# Altium schematic sheet PowerPC_AMCC_PPC405CR_VGA.SchDoc: FPGA PPC405 VGA example
size C; Organization: Altium Limited; Address1: L3, 12a Rodborough Rd; Address2: Frenchs Forest; Address3: NSW; Address4: Australia 2086; DocumentNumber: 1; SheetNumber: 1; SheetTotal: 1
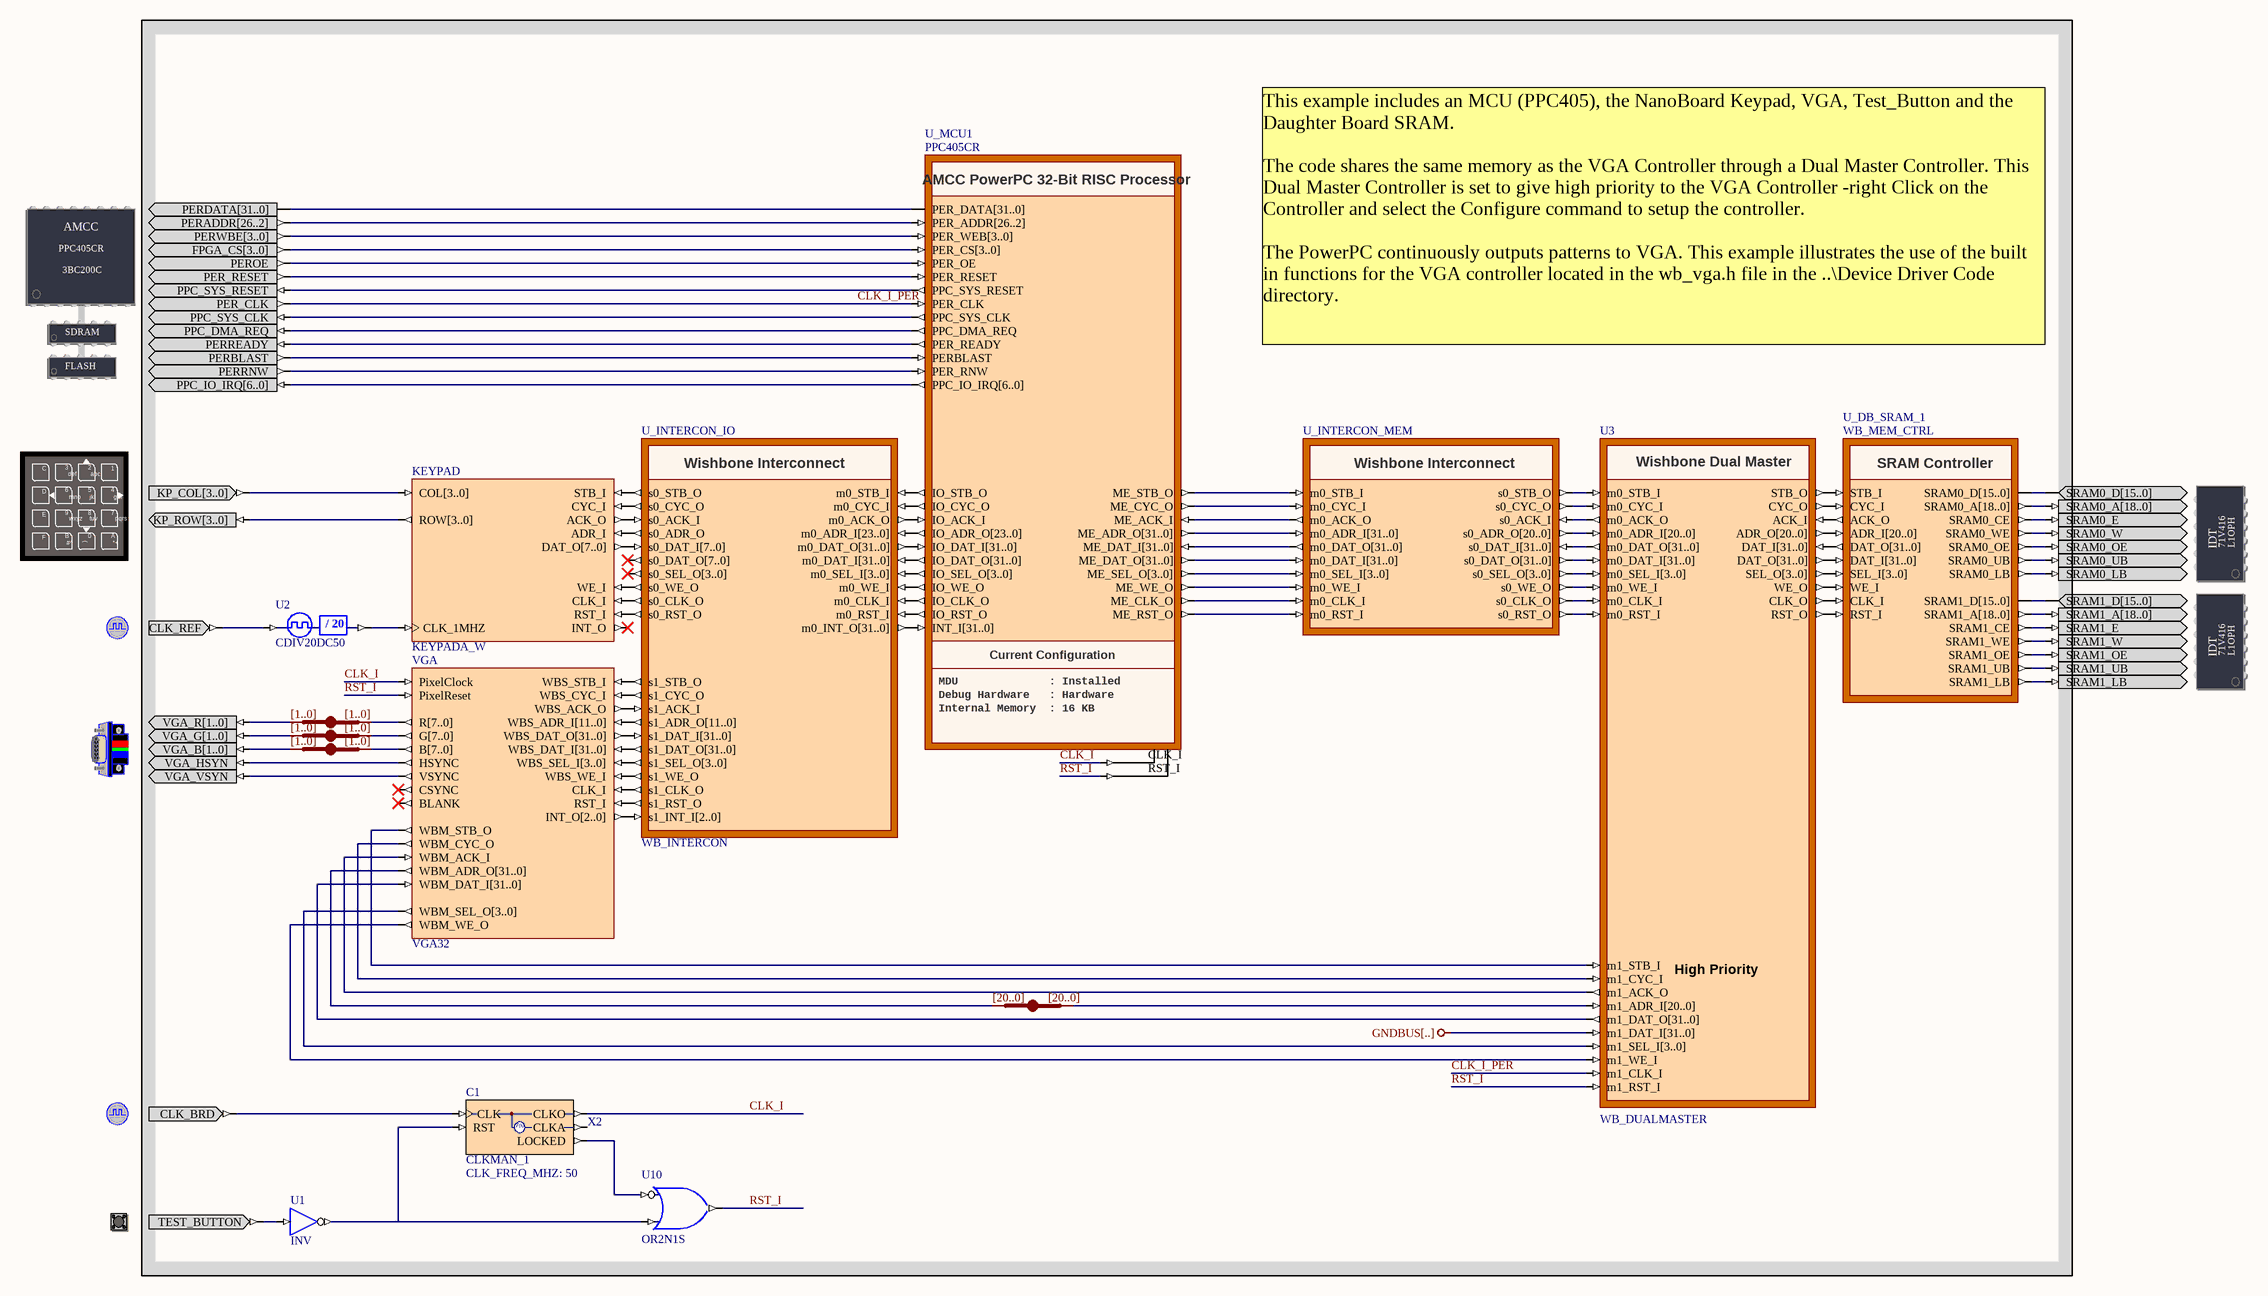
[diagram p0: PowerPC_AMCC_PPC405CR_VGA.SchDoc]

## Parts
(Parts that share a designator on the sheet are numbered #1, #2 ... from top to bottom, then left to right.)
?#1  PROCESSOR_PPC405CR  (value not drawn)
?#2  KEYPAD  (value not drawn)
?#3  SRAM_DAUGHTER0  (value not drawn)
?#4  SRAM_DAUGHTER1  (value not drawn)
?#5  CLOCK_REFERENCE  (value not drawn)
?#6  VGACNTR  (value not drawn)
?#7  CLOCK_BOARD  (value not drawn)
?#8  TEST_BUTTON  (value not drawn)
C1  CLKMAN_1  CLK_FREQ_MHZ: 50  ClkA_Operation: X2
JB_AUTO?#1  IndexA: [1..0]  (hidden comment: JB)
JB_AUTO?#2  IndexA: [1..0]  (hidden comment: JB)
JB_AUTO?#3  IndexA: [1..0]  (hidden comment: JB)
JB_AUTO?#4  IndexA: [20..0]  (hidden comment: JB)
KEYPAD  KEYPADA_W
U1  INV
U2  CDIV20DC50
U3  WB_DUALMASTER
U10  OR2N1S
U_DB_SRAM_1  WB_MEM_CTRL
U_INTERCON_IO  WB_INTERCON
U_INTERCON_MEM  (no value)
U_MCU1  PPC405CR
VGA  VGA32

## Nets
GNDBUS[..]: U3.m1_DAT_I[31..0]
CLK_I: C1.CLKO U_MCU1.CLK_I VGA.PixelClock
CLK_I_PER: ?#1.PER_CLK U3.m1_CLK_I U_MCU1.PER_CLK
RST_I: U3.m1_RST_I U10.O U_MCU1.RST_I VGA.PixelReset
Net?#1_FPGA_CS[3..0]: ?#1.FPGA_CS[3..0] U_MCU1.PER_CS[3..0]
Net?#1_PER_RESET: ?#1.PER_RESET U_MCU1.PER_RESET
Net?#1_PERADDR[26..2]: ?#1.PERADDR[26..2] U_MCU1.PER_ADDR[26..2]
Net?#1_PERBLAST: ?#1.PERBLAST U_MCU1.PERBLAST
Net?#1_PERDATA[31..0]: ?#1.PERDATA[31..0] U_MCU1.PER_DATA[31..0]
Net?#1_PEROE: ?#1.PEROE U_MCU1.PER_OE
Net?#1_PERREADY: ?#1.PERREADY U_MCU1.PER_READY
Net?#1_PERRNW: ?#1.PERRNW U_MCU1.PER_RNW
Net?#1_PERWBE[3..0]: ?#1.PERWBE[3..0] U_MCU1.PER_WEB[3..0]
Net?#1_PPC_DMA_REQ: ?#1.PPC_DMA_REQ U_MCU1.PPC_DMA_REQ
Net?#1_PPC_IO_IRQ[6..0]: ?#1.PPC_IO_IRQ[6..0] U_MCU1.PPC_IO_IRQ[6..0]
Net?#1_PPC_SYS_CLK: ?#1.PPC_SYS_CLK U_MCU1.PPC_SYS_CLK
Net?#1_PPC_SYS_RESET: ?#1.PPC_SYS_RESET U_MCU1.PPC_SYS_RESET
Net?#2_KP_COL[3..0]: ?#2.KP_COL[3..0] KEYPAD.COL[3..0]
Net?#2_KP_ROW[3..0]: ?#2.KP_ROW[3..0] KEYPAD.ROW[3..0]
Net?#3_SRAM0_A[18..0]: ?#3.SRAM0_A[18..0] U_DB_SRAM_1.SRAM0_A[18..0]
Net?#3_SRAM0_D[15..0]: ?#3.SRAM0_D[15..0] U_DB_SRAM_1.SRAM0_D[15..0]
Net?#3_SRAM0_E: ?#3.SRAM0_E U_DB_SRAM_1.SRAM0_CE
Net?#3_SRAM0_LB: ?#3.SRAM0_LB U_DB_SRAM_1.SRAM0_LB
Net?#3_SRAM0_OE: ?#3.SRAM0_OE U_DB_SRAM_1.SRAM0_OE
Net?#3_SRAM0_UB: ?#3.SRAM0_UB U_DB_SRAM_1.SRAM0_UB
Net?#3_SRAM0_W: ?#3.SRAM0_W U_DB_SRAM_1.SRAM0_WE
Net?#4_SRAM1_A[18..0]: ?#4.SRAM1_A[18..0] U_DB_SRAM_1.SRAM1_A[18..0]
Net?#4_SRAM1_D[15..0]: ?#4.SRAM1_D[15..0] U_DB_SRAM_1.SRAM1_D[15..0]
Net?#4_SRAM1_E: ?#4.SRAM1_E U_DB_SRAM_1.SRAM1_CE
Net?#4_SRAM1_LB: ?#4.SRAM1_LB U_DB_SRAM_1.SRAM1_LB
Net?#4_SRAM1_OE: ?#4.SRAM1_OE U_DB_SRAM_1.SRAM1_OE
Net?#4_SRAM1_UB: ?#4.SRAM1_UB U_DB_SRAM_1.SRAM1_UB
Net?#4_SRAM1_W: ?#4.SRAM1_W U_DB_SRAM_1.SRAM1_WE
Net?#5_CLK_REF: ?#5.CLK_REF U2.CLKIN
Net?#6_VGA_B[1..0]: ?#6.VGA_B[1..0] JB_AUTO?#3.A[0..0]
Net?#6_VGA_G[1..0]: ?#6.VGA_G[1..0] JB_AUTO?#2.A[0..0]
Net?#6_VGA_HSYN: ?#6.VGA_HSYN VGA.HSYNC
Net?#6_VGA_R[1..0]: ?#6.VGA_R[1..0] JB_AUTO?#1.A[0..0]
Net?#6_VGA_VSYN: ?#6.VGA_VSYN VGA.VSYNC
Net?#7_CLK_BRD: ?#7.CLK_BRD C1.CLK
Net?#8_TEST_BUTTON: ?#8.TEST_BUTTON U1.I
NetC1_LOCKED: C1.LOCKED U10.I0
NetC1_RST: C1.RST U1.O U10.I1
NetJB_AUTO?#1_B[0..0]: JB_AUTO?#1.B[0..0] VGA.R[7..0]
NetJB_AUTO?#2_B[0..0]: JB_AUTO?#2.B[0..0] VGA.G[7..0]
NetJB_AUTO?#3_B[0..0]: JB_AUTO?#3.B[0..0] VGA.B[7..0]
NetJB_AUTO?#4_A[0..0]: JB_AUTO?#4.A[0..0] VGA.WBM_ADR_O[31..0]
NetJB_AUTO?#4_B[0..0]: JB_AUTO?#4.B[0..0] U3.m1_ADR_I[20..0]
NetKEYPAD_ACK_O: KEYPAD.ACK_O U_INTERCON_IO.s0_ACK_I
NetKEYPAD_ADR_I: KEYPAD.ADR_I U_INTERCON_IO.s0_ADR_O
NetKEYPAD_CLK_1MHZ: KEYPAD.CLK_1MHZ U2.CLKDV
NetKEYPAD_CLK_I: KEYPAD.CLK_I U_INTERCON_IO.s0_CLK_O
NetKEYPAD_CYC_I: KEYPAD.CYC_I U_INTERCON_IO.s0_CYC_O
NetKEYPAD_DAT_O[7..0]: KEYPAD.DAT_O[7..0] U_INTERCON_IO.s0_DAT_I[7..0]
NetKEYPAD_RST_I: KEYPAD.RST_I U_INTERCON_IO.s0_RST_O
NetKEYPAD_STB_I: KEYPAD.STB_I U_INTERCON_IO.s0_STB_O
NetKEYPAD_WE_I: KEYPAD.WE_I U_INTERCON_IO.s0_WE_O
NetU3_ACK_I: U3.ACK_I U_DB_SRAM_1.ACK_O
NetU3_ADR_O[20..0]: U3.ADR_O[20..0] U_DB_SRAM_1.ADR_I[20..0]
NetU3_CLK_O: U3.CLK_O U_DB_SRAM_1.CLK_I
NetU3_CYC_O: U3.CYC_O U_DB_SRAM_1.CYC_I
NetU3_DAT_I[31..0]: U3.DAT_I[31..0] U_DB_SRAM_1.DAT_O[31..0]
NetU3_DAT_O[31..0]: U3.DAT_O[31..0] U_DB_SRAM_1.DAT_I[31..0]
NetU3_m0_ACK_O: U3.m0_ACK_O U_INTERCON_MEM.s0_ACK_I
NetU3_m0_ADR_I[20..0]: U3.m0_ADR_I[20..0] U_INTERCON_MEM.s0_ADR_O[20..0]
NetU3_m0_CLK_I: U3.m0_CLK_I U_INTERCON_MEM.s0_CLK_O
NetU3_m0_CYC_I: U3.m0_CYC_I U_INTERCON_MEM.s0_CYC_O
NetU3_m0_DAT_I[31..0]: U3.m0_DAT_I[31..0] U_INTERCON_MEM.s0_DAT_O[31..0]
NetU3_m0_DAT_O[31..0]: U3.m0_DAT_O[31..0] U_INTERCON_MEM.s0_DAT_I[31..0]
NetU3_m0_RST_I: U3.m0_RST_I U_INTERCON_MEM.s0_RST_O
NetU3_m0_SEL_I[3..0]: U3.m0_SEL_I[3..0] U_INTERCON_MEM.s0_SEL_O[3..0]
NetU3_m0_STB_I: U3.m0_STB_I U_INTERCON_MEM.s0_STB_O
NetU3_m0_WE_I: U3.m0_WE_I U_INTERCON_MEM.s0_WE_O
NetU3_m1_ACK_O: U3.m1_ACK_O VGA.WBM_ACK_I
NetU3_m1_CYC_I: U3.m1_CYC_I VGA.WBM_CYC_O
NetU3_m1_DAT_O[31..0]: U3.m1_DAT_O[31..0] VGA.WBM_DAT_I[31..0]
NetU3_m1_SEL_I[3..0]: U3.m1_SEL_I[3..0] VGA.WBM_SEL_O[3..0]
NetU3_m1_STB_I: U3.m1_STB_I VGA.WBM_STB_O
NetU3_m1_WE_I: U3.m1_WE_I VGA.WBM_WE_O
NetU3_RST_O: U3.RST_O U_DB_SRAM_1.RST_I
NetU3_SEL_O[3..0]: U3.SEL_O[3..0] U_DB_SRAM_1.SEL_I[3..0]
NetU3_STB_O: U3.STB_O U_DB_SRAM_1.STB_I
NetU3_WE_O: U3.WE_O U_DB_SRAM_1.WE_I
NetU_INTERCON_IO_m0_ACK_O: U_INTERCON_IO.m0_ACK_O U_MCU1.IO_ACK_I
NetU_INTERCON_IO_m0_ADR_I[23..0]: U_INTERCON_IO.m0_ADR_I[23..0] U_MCU1.IO_ADR_O[23..0]
NetU_INTERCON_IO_m0_CLK_I: U_INTERCON_IO.m0_CLK_I U_MCU1.IO_CLK_O
NetU_INTERCON_IO_m0_CYC_I: U_INTERCON_IO.m0_CYC_I U_MCU1.IO_CYC_O
NetU_INTERCON_IO_m0_DAT_I[31..0]: U_INTERCON_IO.m0_DAT_I[31..0] U_MCU1.IO_DAT_O[31..0]
NetU_INTERCON_IO_m0_DAT_O[31..0]: U_INTERCON_IO.m0_DAT_O[31..0] U_MCU1.IO_DAT_I[31..0]
NetU_INTERCON_IO_m0_INT_O[31..0]: U_INTERCON_IO.m0_INT_O[31..0] U_MCU1.INT_I[31..0]
NetU_INTERCON_IO_m0_RST_I: U_INTERCON_IO.m0_RST_I U_MCU1.IO_RST_O
NetU_INTERCON_IO_m0_SEL_I[3..0]: U_INTERCON_IO.m0_SEL_I[3..0] U_MCU1.IO_SEL_O[3..0]
NetU_INTERCON_IO_m0_STB_I: U_INTERCON_IO.m0_STB_I U_MCU1.IO_STB_O
NetU_INTERCON_IO_m0_WE_I: U_INTERCON_IO.m0_WE_I U_MCU1.IO_WE_O
NetU_INTERCON_IO_s1_ACK_I: U_INTERCON_IO.s1_ACK_I VGA.WBS_ACK_O
NetU_INTERCON_IO_s1_ADR_O[11..0]: U_INTERCON_IO.s1_ADR_O[11..0] VGA.WBS_ADR_I[11..0]
NetU_INTERCON_IO_s1_CLK_O: U_INTERCON_IO.s1_CLK_O VGA.CLK_I
NetU_INTERCON_IO_s1_CYC_O: U_INTERCON_IO.s1_CYC_O VGA.WBS_CYC_I
NetU_INTERCON_IO_s1_DAT_I[31..0]: U_INTERCON_IO.s1_DAT_I[31..0] VGA.WBS_DAT_O[31..0]
NetU_INTERCON_IO_s1_DAT_O[31..0]: U_INTERCON_IO.s1_DAT_O[31..0] VGA.WBS_DAT_I[31..0]
NetU_INTERCON_IO_s1_INT_I[2..0]: U_INTERCON_IO.s1_INT_I[2..0] VGA.INT_O[2..0]
NetU_INTERCON_IO_s1_RST_O: U_INTERCON_IO.s1_RST_O VGA.RST_I
NetU_INTERCON_IO_s1_SEL_O[3..0]: U_INTERCON_IO.s1_SEL_O[3..0] VGA.WBS_SEL_I[3..0]
NetU_INTERCON_IO_s1_STB_O: U_INTERCON_IO.s1_STB_O VGA.WBS_STB_I
NetU_INTERCON_IO_s1_WE_O: U_INTERCON_IO.s1_WE_O VGA.WBS_WE_I
NetU_INTERCON_MEM_m0_ACK_O: U_INTERCON_MEM.m0_ACK_O U_MCU1.ME_ACK_I
NetU_INTERCON_MEM_m0_ADR_I[31..0]: U_INTERCON_MEM.m0_ADR_I[31..0] U_MCU1.ME_ADR_O[31..0]
NetU_INTERCON_MEM_m0_CLK_I: U_INTERCON_MEM.m0_CLK_I U_MCU1.ME_CLK_O
NetU_INTERCON_MEM_m0_CYC_I: U_INTERCON_MEM.m0_CYC_I U_MCU1.ME_CYC_O
NetU_INTERCON_MEM_m0_DAT_I[31..0]: U_INTERCON_MEM.m0_DAT_I[31..0] U_MCU1.ME_DAT_O[31..0]
NetU_INTERCON_MEM_m0_DAT_O[31..0]: U_INTERCON_MEM.m0_DAT_O[31..0] U_MCU1.ME_DAT_I[31..0]
NetU_INTERCON_MEM_m0_RST_I: U_INTERCON_MEM.m0_RST_I U_MCU1.ME_RST_O
NetU_INTERCON_MEM_m0_SEL_I[3..0]: U_INTERCON_MEM.m0_SEL_I[3..0] U_MCU1.ME_SEL_O[3..0]
NetU_INTERCON_MEM_m0_STB_I: U_INTERCON_MEM.m0_STB_I U_MCU1.ME_STB_O
NetU_INTERCON_MEM_m0_WE_I: U_INTERCON_MEM.m0_WE_I U_MCU1.ME_WE_O

Not connected (* = marked no-connect by the designer): C1 CLKA; KEYPAD INT_O*; U_INTERCON_IO s0_DAT_O[7..0]* s0_SEL_O[3..0]*; VGA BLANK* CSYNC*

## Notes on the sheet
- This example includes an MCU (PPC405), the NanoBoard Keypad, VGA, Test_Button and the Daughter Board SRAM.
  The code shares the same memory as the VGA Controller through a Dual Master Controller. This Dual Master Controller is set to give high priority to the VGA Controller -right Click on the Controller and select the Configure command to setup the controller.
  The PowerPC continuously outputs patterns to VGA. This example illustrates the use of the built in functions for the VGA controller located in the wb_vga.h file in the ..\Device Driver Code directory.
- Title
- Size:
- Date:
- File:
- C
- Number:
- Time:
- Revision:
- Sheet
- of
- (in symbol CDIV20DC50) / 20
- (in symbol CLKMAN_1) F(x)
- (in symbol KEYPAD) C; 3; 2; 1; def; abc; 6; 5; 4; D; mno; jkl; ghi; E; 9; 8; 7; wxyz; tuv; pqrs; F; B; 0; A; #^; (; *+
- (in symbol PPC405CR) AMCC PowerPC 32-Bit RISC Processor; Current Configuration; MDU              : Installed; Debug Hardware   : Hardware; Internal Memory  : 16 KB
- (in symbol PROCESSOR_PPC405CR) AMCC; PPC405CR; 3BC200C; SDRAM; FLASH
- (in symbol SRAM_DAUGHTER0) IDT; 71V416; L1OPH
- (in symbol SRAM_DAUGHTER1) IDT; 71V416; L1OPH
- (in symbol WB_DUALMASTER) Wishbone Dual Master; High Priority
- (in symbol WB_INTERCON) Wishbone Interconnect
- (in symbol WB_MEM_CTRL) SRAM Controller

## Library data of the parts
?#1 = PROCESSOR_PPC405CR: AMCC PowerPC 405CR Embedded Processor; PortComponent: True; Published: 25-Aug-2005; Publisher: Altium Limited; HelpURL: https://www.amcc.com/MyAMCC/jsp/public/productDetail/product_detail.jsp?productID=PPC405CR
?#2 = KEYPAD: Key Pad; PortComponent: True; Published: 19-Nov-2003; Publisher: Altium Limited; HelpURL: TR0102 NanoBoard Technical Reference Manual - NB1.pdf#page=40
?#3 = SRAM_DAUGHTER0: SRAM - 0 Module - Daughterboard; PortComponent: True; Published: 13-May-2004; Publisher: Altium Limited
?#4 = SRAM_DAUGHTER1: SRAM - 1 Module - Daughterboard; PortComponent: True; Published: 13-May-2004; Publisher: Altium Limited
?#5 = CLOCK_REFERENCE: Global System Clock Reference Supply; PortComponent: True; Published: 19-Nov-2003; Publisher: Altium Limited; HelpURL: TR0102 NanoBoard Technical Reference Manual - NB1.pdf#page=29
?#6 = VGACNTR: VGA Dsub-15-Female-HD; PortComponent: True; Published: 19-Nov-2003; Publisher: Altium Limited; HelpURL: TR0102 NanoBoard Technical Reference Manual - NB1.pdf#page=37
?#7 = CLOCK_BOARD: Global System Clock Supply; PortComponent: True; Published: 19-Nov-2003; Publisher: Altium Limited
?#8 = TEST_BUTTON: Test Button; PortComponent: True; Published: 19-Nov-2003; Publisher: Altium Limited
C1 = CLKMAN_1: Single Operational Output Clock Manager; Clk_Count: 1; Published: 5-Jul-2004; Publisher: Altium Limited; LastRevisionNo: 1.00.00; Nexus_Core: ClockManager; HelpURL: CR0118 FPGA Generic Library Guide.pdf#page=149; ComponentLink1URL: CR0128 FPGA Clock Manager Resource Usage.pdf#page=2; ComponentLink1Description: Core &Resource Usage; FunctionalClass: Clock Manager; PortSize: 1
JB_AUTO?#1-JB_AUTO?#4 = JB: System BUS Joiner; Published: 29-Jan-2004; Publisher: Altium Limited; LastRevisionNo: 1.00.00; HelpURL: CR0118 FPGA Generic Library Guide.pdf#page=296; FunctionalClass: Bus Joiner
  JB_AUTO?#1-JB_AUTO?#3: IndexB: [1..0]
  JB_AUTO?#4: IndexB: [20..0]
KEYPAD = KEYPADA_W: Keypad Wishbone; Published: 3-Nov-2004; Publisher: Altium Limited; LastRevisionNo: 1.00.00; HelpURL: CR0106 Keypad Controller.pdf#page=2; ComponentLink1Description: Core &Resource Usage; ComponentLink1URL: CR0139 FPGA Peripheral Resource Usage.pdf#page=15
U1 = INV: Inverter; ArchiveName: GENERIC; FunctionalClass: Logic Primitive; VHDLIB_SIM: GENERIC_LIB; Published: 18-Dec-2003; Publisher: Altium Limited; ComponentLink1Description: Core &Resource Usage; ComponentLink1URL: CR0136 FPGA Logic Primitive Resource Usage.pdf#page=61; HelpURL: CR0118 FPGA Generic Library Guide.pdf#page=290; LastRevisionNo: 1.00.00; SubClass: INV; XilinxEquivalent: INV
U2 = CDIV20DC50: Clock Divider by 20 with 50% Duty Cycle Output; DivisorRate: 20; DutyCycle: 50; ArchiveName: GENERIC; VHDLIB_SIM: GENERIC_LIB; Published: 29-Jan-2004; Publisher: Altium Limited; LastRevisionNo: 1.00.00; HelpURL: CR0118 FPGA Generic Library Guide.pdf#page=142; ComponentLink1URL: CR0127 FPGA Clock Divider Resource Usage.pdf#page=21; ComponentLink1Description: Core &Resource Usage; FunctionalClass: Clock Divider
U3 = WB_DUALMASTER: Configurable Wishbone Dual Master; ConfigurationParameters: {}Version[1.0]{}DataWidth[0]{}AddressWidth[21]{}SpaceAfter[26]{}DualType[1]{}PriorityDevice[1]; ComponentLink1Description: Core &Resource Usage; ComponentLink1URL: CR0139 FPGA Peripheral Resource Usage.pdf#page=46; HelpURL: CR0151 WB_DUALMASTER Configurable Wishbone Dual Master.pdf; LastRevisionNo: 1.00.00; Published: 9-Dec-2004; Publisher: Altium Limited; ConfiguratorName: WB_DUALMASTER
U10 = OR2N1S: 2-Input OR Gate with Active Low A Input, Single Pin Version; Xilinx Equivalent: OR2B1; ArchiveName: GENERIC; VHDLIB_SIM: GENERIC_LIB; Published: 29-Jan-2004; Publisher: Altium Limited; Core Revision: 1.00.00
U_DB_SRAM_1 = WB_MEM_CTRL: Configurable Memory Controller; ConfigurationParameters: {}Version[1.0]{}Option_MemoryType[Asynchronous SRAM]{}Option_MemorySize[2 Mb (512K x 32-bit)]{}Option_Layout[2 x 16-bit Wide Devices]{}Option_Read[2]{}Option_WriteSetup[1]{}Option_WritePulse[1]{}Option_WriteHold[1]{}; ComponentLink1Description: Core &Resource Usage; ComponentLink1URL: CR0139 FPGA Peripheral Resource Usage.pdf#page=58; HelpURL: CR0152 WB_MEM_CTRL Configurable Wishbone Memory Controller.pdf#page=2; LastRevisionNo: 1.00.00; Published: 9-Dec-2004; Publisher: Altium Limited; ConfiguratorName: WB_MEM_CTRL
U_INTERCON_IO = WB_INTERCON: Configurable Wishbone Interconnect; ConfigurationParameters: {}UnusedInterrupts[1]{}MasterAddressBits[1]{}Name0[KeyPad]{}Kind0[0]{}SpaceAfter0[4]{}Address_Base0[1048576]{}Address_UsedRange0[1]{}Address_Bits0[1]{}Address_Mode0[1]{}Address_DecodeWidth0[4]{}DataWidth0[2]{}UsedInterrupts0[]{}Name1[Video]{}Kind1[0]{}SpaceAfter1[4]{}Address_Base1[0]{}Address_UsedRange1[4]{}Address_Bits1[12]{}Address_Mode1[1]{}Address_DecodeWidth1[4]{}DataWidth1[0]{}UsedInterrupts1[2, 3, 4]; ComponentLink1Description: Core &Resource Usage; ComponentLink1URL: CR0139 FPGA Peripheral Resource Usage.pdf#page=51; HelpURL: CR0150 WB_INTERCON Configurable Wishbone Interconnect.pdf#page=2; LastRevisionNo: 1.00.00; Published: 9-Dec-2004; Publisher: Altium Limited; ConfiguratorName: WB_INTERCON
U_INTERCON_MEM = WB_INTERCON: Configurable Wishbone Interconnect; ConfigurationParameters: {}Version[1.0]{}UnusedInterrupts[2]{}MasterAddressBits[0]{}Name0[Daughter_SRAM]{}Kind0[2]{}SpaceAfter0[14]{}Address_Base0[16777216]{}Address_UsedRange0[524288]{}Address_Bits0[21]{}Address_Mode0[1]{}Address_DecodeWidth0[8]{}DataWidth0[0]{}UsedInterrupts0[ ]; ComponentLink1Description: Core &Resource Usage; ComponentLink1URL: CR0139 FPGA Peripheral Resource Usage.pdf#page=51; HelpURL: CR0150 WB_INTERCON Configurable Wishbone Interconnect.pdf#page=2; LastRevisionNo: 1.00.00; Published: 9-Dec-2004; Publisher: Altium Limited; ConfiguratorName: WB_INTERCON
U_MCU1 = PPC405CR: AMCC PowerPC PPC405 RISC Processor; ChildModel1: TSK3000A_MCU; Nexus_JTAG_Device: False; Nexus_Core: Processor_Hard; Nexus_JTAG_Order: 10; ProgramLogicalTopAddress: 0; ChildModel2: TSK3000A_MDU; ChildModel3: TSK3000A_OCDS; ChildModel4: TSK3000A_Shift_Barrel; ChildModel5: TSK3000A_Shift_Sequential; ChildModel6: Mult_32x32; ConfigurationParameters: {}Version[1.0]{}Option_Processor[2]{}Option_Memory[4]{}Option_MDU[0]{}Option_OCDS[2]{}Option_Shifter[0]{}Option_InterruptCount[32]{}Option_DebugWhenReset[0]{}; ChildModel7: m33x33; Memory_Configuration: Record[CODE_EXPORT]{}ExportType[1]{n}Record[PERIPHERAL]{}ComponentDesignator[KeyPad]{}Memory_Depth[0x0002]{}Memory_UsageType[ram]{}ProgramDownloadAddress[0xFF100000]{}Memory_BusType[PPC:local_bus]{}Memory_Mau[8]{}Memory_MatchedComponent[]{}Memory_Description[U_INTERCON_IO]{}Memory_FillBitPattern[]{}Memory_Interrupts[]{n}Record[PERIPHERAL]{}ComponentDesignator[Video]{}Memory_Depth[0x1000]{}Memory_UsageType[ram]{}ProgramDownloadAddress[0xFF000000]{}Memory_BusType[PPC:local_bus]{}Memory_Mau[8]{}Memory_MatchedComponent[]{}Memory_Description[U_INTERCON_IO]{}Memory_FillBitPattern[]{}Memory_Interrupts[2, 3, 4]{n}; ConfiguratorName: FPGA_MCU32; ComponentLink1Description: Core &Resource Usage; ComponentLink1URL: CR0140 FPGA Processor Resource Usage.pdf#page=16; HelpURL: CR0121 TSK3000A 32 bit RISC Processor.pdf#page=6; LastRevisionNo: 1.00.00; Published: 17-Nov-2004; Publisher: Altium Limited